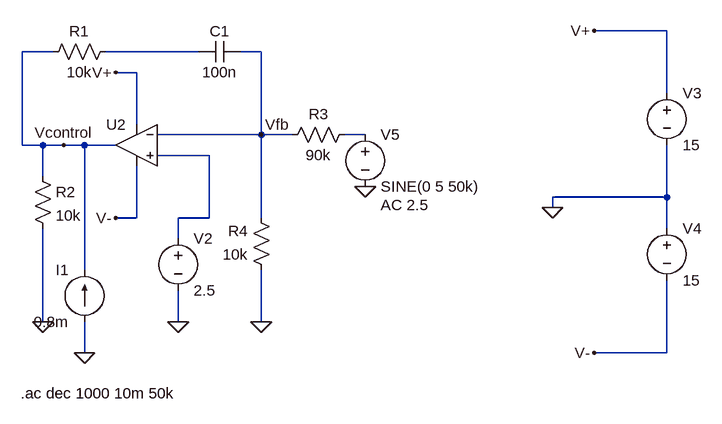
[diagram p0: schematic Draft3.asc]
Draft3.asc, the LTspice schematic file:
Version 4
SHEET 1 880 680
WIRE 704 -96 592 -96
WIRE -240 -64 -288 -64
WIRE -16 -64 -160 -64
WIRE 80 -64 48 -64
WIRE -112 -32 -144 -32
WIRE 704 0 704 -96
WIRE -112 48 -112 -32
WIRE 80 64 80 -64
WIRE 80 64 -80 64
WIRE 128 64 80 64
WIRE 240 64 208 64
WIRE -288 80 -288 -64
WIRE -256 80 -288 80
WIRE -224 80 -256 80
WIRE -192 80 -224 80
WIRE -144 80 -192 80
WIRE 0 96 -80 96
WIRE -256 128 -256 80
WIRE 704 160 704 80
WIRE 704 160 528 160
WIRE 528 176 528 160
WIRE -112 192 -112 112
WIRE -112 192 -144 192
WIRE 0 192 0 96
WIRE 0 192 -48 192
WIRE 80 192 80 64
WIRE 704 208 704 160
WIRE -48 224 -48 192
WIRE -192 272 -192 80
WIRE -256 352 -256 208
WIRE -48 352 -48 304
WIRE 80 352 80 272
WIRE -192 400 -192 352
WIRE 704 400 704 288
WIRE 704 400 592 400
FLAG -48 352 0
FLAG -192 400 0
FLAG 80 352 0
FLAG 528 176 0
FLAG 592 -96 V+
FLAG 592 400 V-
FLAG -144 -32 V+
FLAG -144 192 V-
FLAG 80 64 Vfb
FLAG -224 80 Vcontrol
FLAG 240 144 0
FLAG -256 352 0
SYMBOL res -144 -80 R90
WINDOW 0 0 56 VBottom 2
WINDOW 3 32 56 VTop 2
SYMATTR InstName R1
SYMATTR Value 10k
SYMBOL cap 48 -80 R90
WINDOW 0 0 32 VBottom 2
WINDOW 3 32 32 VTop 2
SYMATTR InstName C1
SYMATTR Value 100n
SYMBOL Opamps\\UniversalOpamp2 -112 80 M0
SYMATTR InstName U2
SYMBOL voltage -48 208 R0
WINDOW 123 0 0 Left 0
WINDOW 39 0 0 Left 0
SYMATTR InstName V2
SYMATTR Value 2.5
SYMBOL res -272 112 R0
SYMATTR InstName R2
SYMATTR Value 10k
SYMBOL current -192 352 R180
WINDOW 0 24 80 Left 2
WINDOW 3 24 0 Left 2
WINDOW 123 0 0 Left 0
WINDOW 39 0 0 Left 0
SYMATTR InstName I1
SYMATTR Value 0.8m
SYMBOL res 224 48 R90
WINDOW 0 0 56 VBottom 2
WINDOW 3 32 56 VTop 2
SYMATTR InstName R3
SYMATTR Value 90k
SYMBOL res 96 288 R180
WINDOW 0 36 76 Left 2
WINDOW 3 36 40 Left 2
SYMATTR InstName R4
SYMATTR Value 10k
SYMBOL voltage 704 -16 R0
WINDOW 123 0 0 Left 0
WINDOW 39 0 0 Left 0
SYMATTR InstName V3
SYMATTR Value 15
SYMBOL voltage 704 192 R0
WINDOW 123 0 0 Left 0
WINDOW 39 0 0 Left 0
SYMATTR InstName V4
SYMATTR Value 15
SYMBOL voltage 240 48 R0
WINDOW 123 24 124 Left 2
WINDOW 39 0 0 Left 0
SYMATTR Value2 AC 2.5
SYMATTR InstName V5
SYMATTR Value SINE(0 5 50k)
TEXT -290 462 Left 2 !.ac dec 1000 10m 50k

The netlist it stands for:
* Draft3.asc
R1 N001 Vcontrol 10k
C1 Vfb N001 100n
XU2 N003 Vfb V+ V- Vcontrol level.2 Avol=1Meg GBW=10Meg Slew=10Meg ilimit=25m rail=0 Vos=0 phimargin=45 en=0 enk=0 in=0 ink=0 Rin=500Meg  ; pins IN+ IN- V+ V- OUT
V2 N003 0 2.5
R2 Vcontrol 0 10k
I1 0 Vcontrol 0.8m
R3 N002 Vfb 90k
R4 0 Vfb 10k
V3 V+ 0 15
V4 0 V- 15
V5 N002 0 SINE(0 5 50k) AC 2.5
.ac dec 1000 10m 50k
.lib UniversalOpamps2.sub
.backanno
.end